# EAGLE design PoE_Mag-revc (EAGLE 8.5.0)
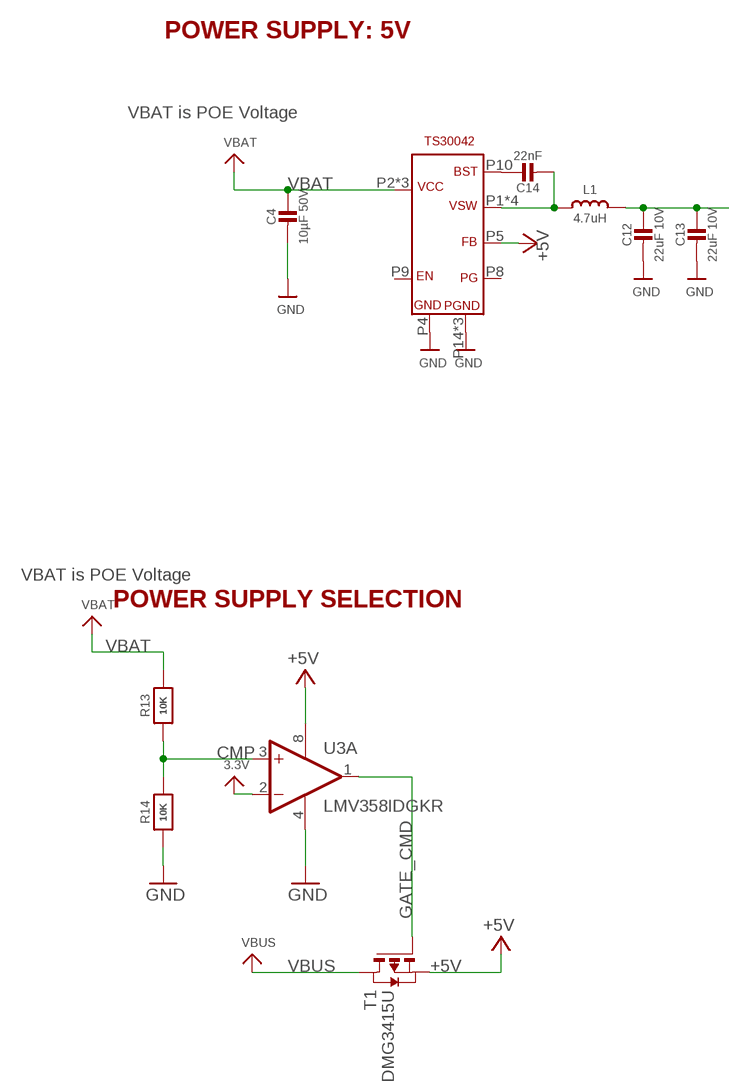
[diagram p0: schematic, sheet 1, part 1 of 2]
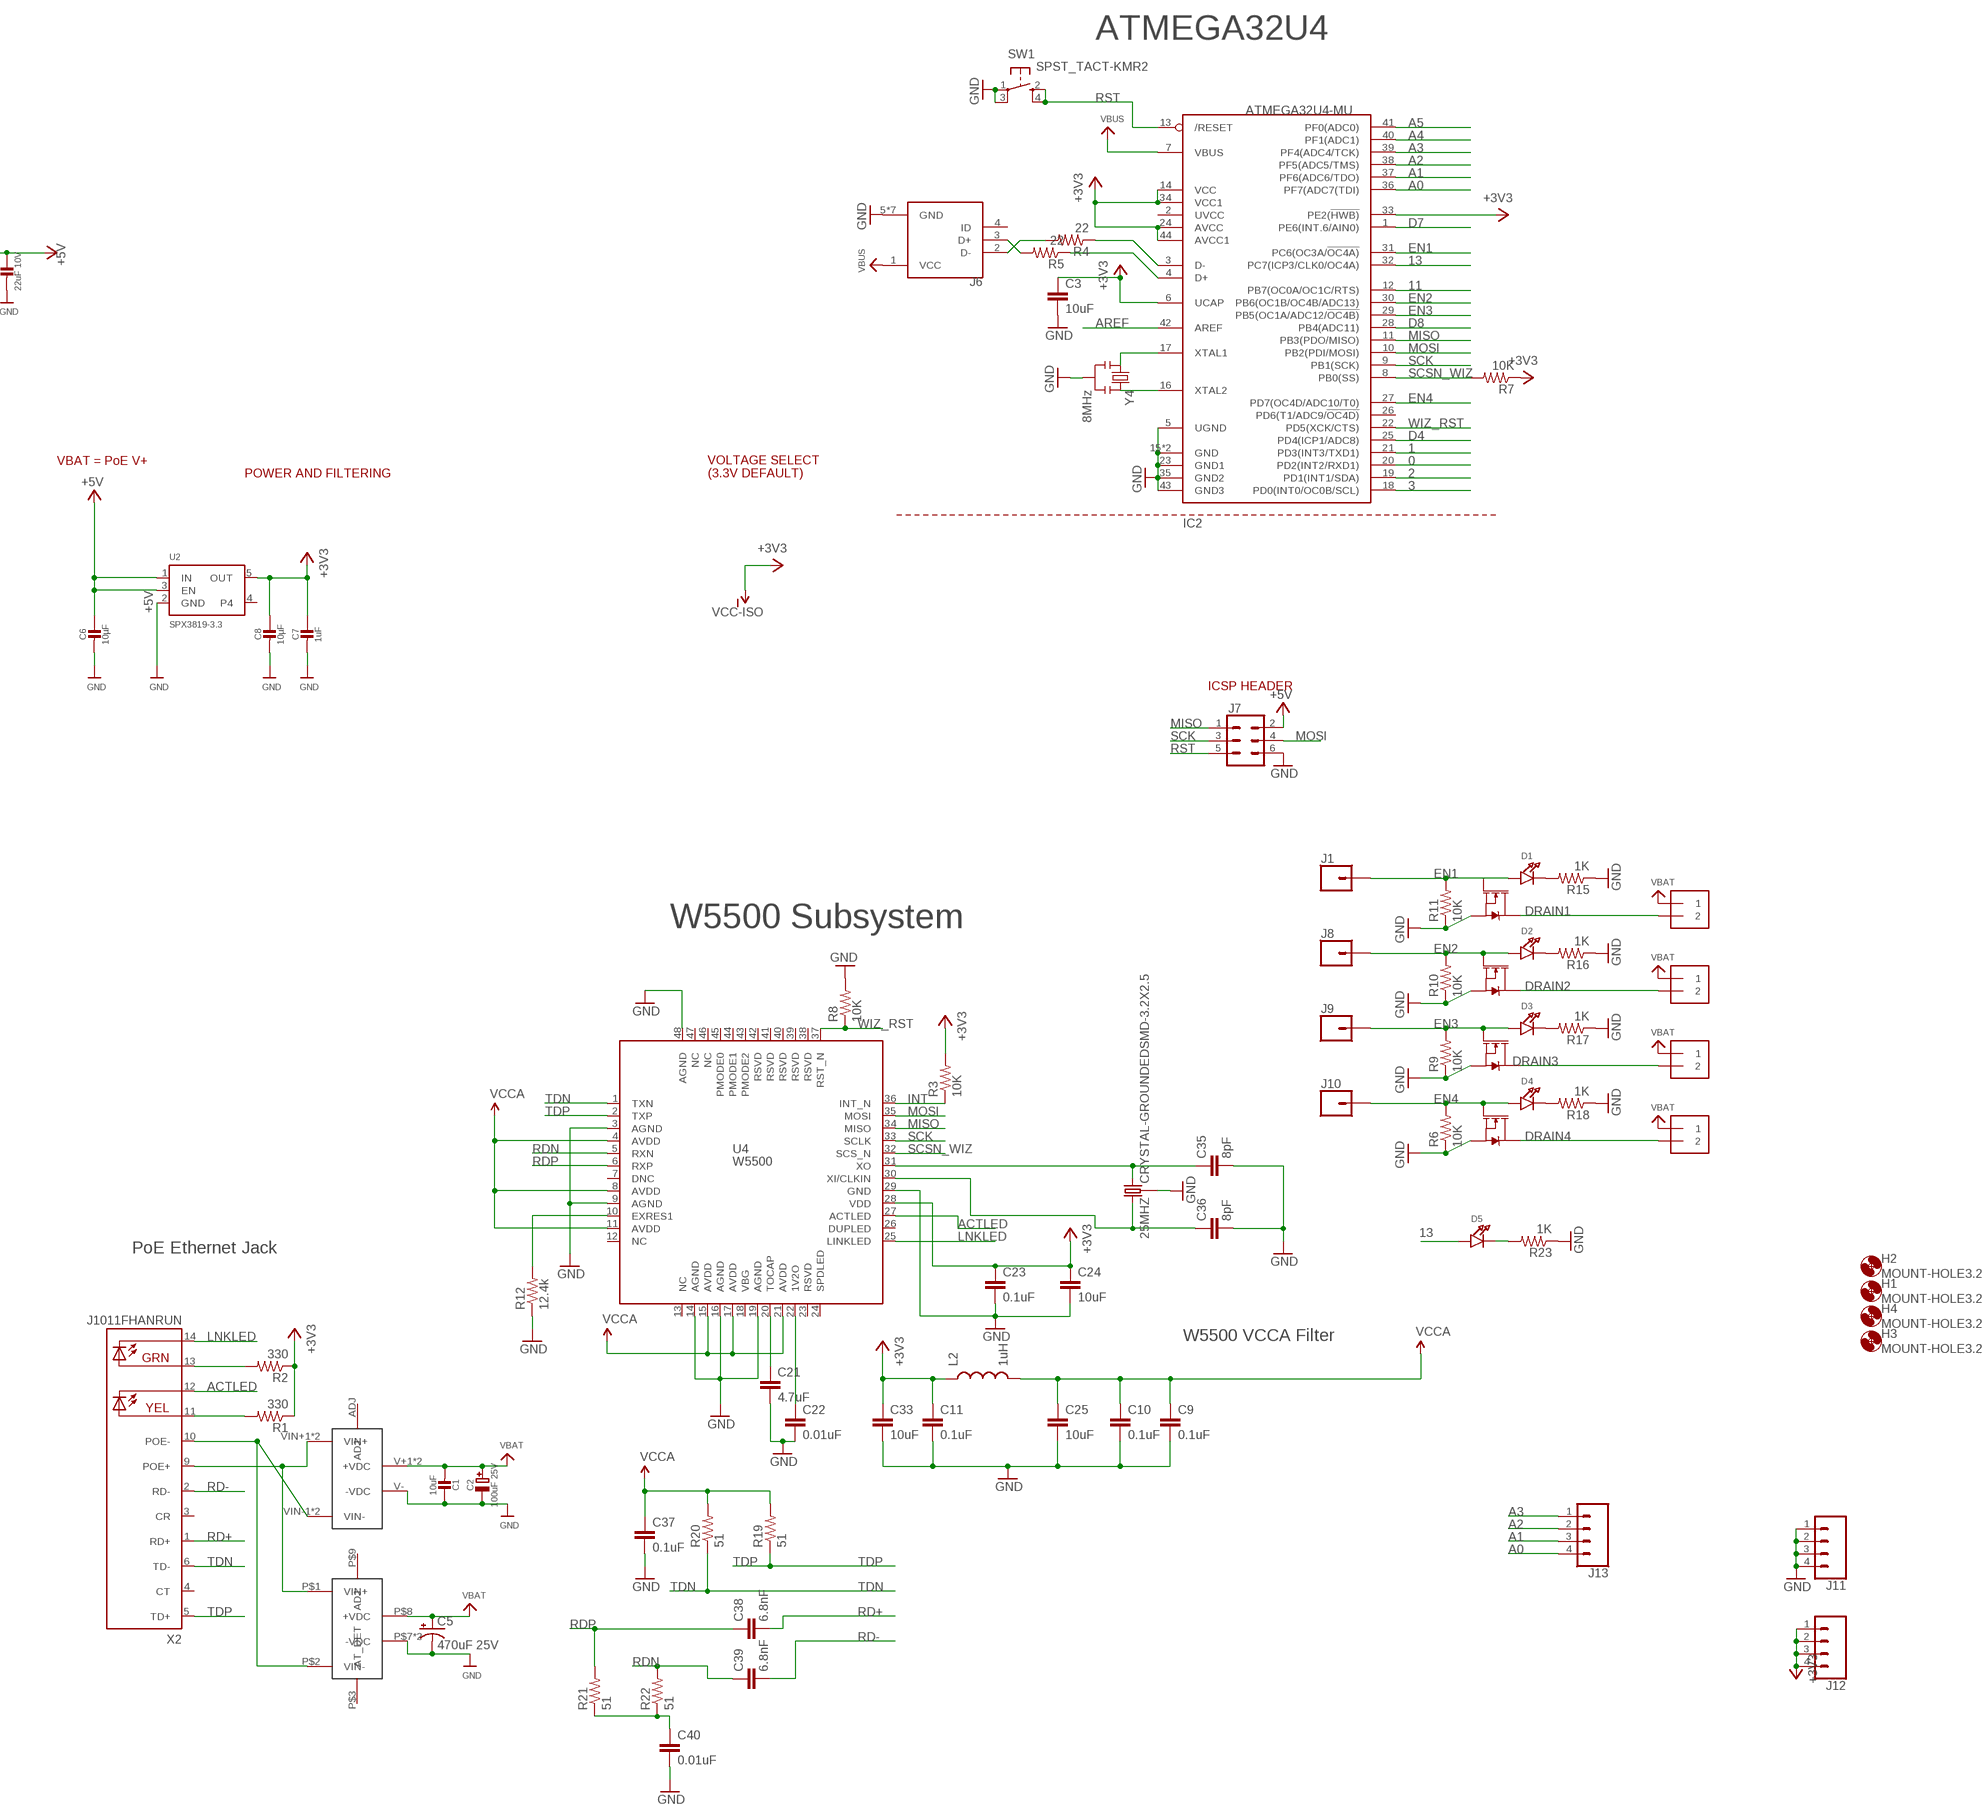
[diagram p1: schematic, sheet 1, part 2 of 2]

## Parts
25MHZ  CRYSTAL-GROUNDEDSMD-3.2X2.5  [CRYSTAL-SMD-3.2X2.5MM]
C1  10uF  CAP_CERAMIC_0805MP  [_0805MP]
C2  100uF 25V  CAP_ELECTROLYTICPANASONIC_D  [PANASONIC_D]
C3  10uF  CAP0603-CAP  [0603-CAP]
C4  10µF 50V  CAP_CERAMIC0603MINI  [0603-MINI]
C5  470uF 25V  CAP_POLG  [PANASONIC_G]
C6  10µF  CAP_CERAMIC0603MINI  [0603-MINI]
C7  1uF  CAP_CERAMIC0603MINI  [0603-MINI]
C8  10µF  CAP_CERAMIC0603MINI  [0603-MINI]
C9  0.1uF  CAP0603-CAP  [0603-CAP]
C10  0.1uF  CAP0603-CAP  [0603-CAP]
C11  0.1uF  CAP0603-CAP  [0603-CAP]
C12  22uF 10V  CAP_CERAMIC0603MINI  [0603-MINI]
C13  22uF 10V  CAP_CERAMIC0603MINI  [0603-MINI]
C14  22nF  CAP_CERAMIC0603MINI  [0603-MINI]
C21  4.7uF  CAP0603-CAP  [0603-CAP]
C22  0.01uF  CAP0603-CAP  [0603-CAP]
C23  0.1uF  CAP0603-CAP  [0603-CAP]
C24  10uF  CAP0603-CAP  [0603-CAP]
C25  10uF  CAP0603-CAP  [0603-CAP]
C33  10uF  CAP0603-CAP  [0603-CAP]
C35  8pF  CAP0603-CAP  [0603-CAP]
C36  8pF  CAP0603-CAP  [0603-CAP]
C37  0.1uF  CAP0603-CAP  [0603-CAP]
C38  6.8nF  CAP0603-CAP  [0603-CAP]
C39  6.8nF  CAP0603-CAP  [0603-CAP]
C40  0.01uF  CAP0603-CAP  [0603-CAP]
D1  LED0805_NOOUTLINE  [CHIPLED_0805_NOOUTLINE]
D2  LED0805_NOOUTLINE  [CHIPLED_0805_NOOUTLINE]
D3  LED0805_NOOUTLINE  [CHIPLED_0805_NOOUTLINE]
D4  LED0805_NOOUTLINE  [CHIPLED_0805_NOOUTLINE]
D5  LED0805_NOOUTLINE  [CHIPLED_0805_NOOUTLINE]
H1  MOUNT-HOLE3.2  [3,2]
H2  MOUNT-HOLE3.2  [3,2]
H3  MOUNT-HOLE3.2  [3,2]
H4  MOUNT-HOLE3.2  [3,2]
IC2  ATMEGA32U4-MU  [TQFN44_7MM]
J1  CONN_01  [1X01]
J2  1X2-3.5MM  [1X2-3.5MM]
J3  1X2-3.5MM  [1X2-3.5MM]
J4  1X2-3.5MM  [1X2-3.5MM]
J5  1X2-3.5MM  [1X2-3.5MM]
J6  10103594-0001LF  [FCI_10103594-0001LF]
J7  CONN_03X2NO_SILK  [2X3-NS]
J8  CONN_01  [1X01]
J9  CONN_01  [1X01]
J10  CONN_01  [1X01]
J11  CONN_04  [1X04]
J12  CONN_04  [1X04]
J13  CONN_041X04_NO_SILK  [1X04_NO_SILK]
L1  4.7uH  INDUCTORTDK_VLC5045  [INDUCTOR_5X5MM_TDK_VLC5045]
L2  1uH  INDUCTOR0603  [0603]
Q1  35A/25V/8.5mΩ  MOSFET-NCH-FDD8780  [DPAK]
Q3  35A/25V/8.5mΩ  MOSFET-NCH-FDD8780  [DPAK]
Q5  35A/25V/8.5mΩ  MOSFET-NCH-FDD8780  [DPAK]
Q6  35A/25V/8.5mΩ  MOSFET-NCH-FDD8780  [DPAK]
R1  330  RESISTOR0603-RES  [0603-RES]
R2  330  RESISTOR0603-RES  [0603-RES]
R3  10K  RESISTOR0603-RES  [0603-RES]
R4  22  RESISTOR0603-RES  [0603-RES]
R5  22  RESISTOR0603-RES  [0603-RES]
R6  10K  RESISTOR0603-RES  [0603-RES]
R7  10K  RESISTOR0603-RES  [0603-RES]
R8  10K  RESISTOR0603-RES  [0603-RES]
R9  10K  RESISTOR0603-RES  [0603-RES]
R10  10K  RESISTOR0603-RES  [0603-RES]
R11  10K  RESISTOR0603-RES  [0603-RES]
R12  12.4k  RESISTOR0603-RES  [0603-RES]
R13  10K  RESISTOR_0603_NOOUT  [0603-NO]
R14  10K  RESISTOR_0603_NOOUT  [0603-NO]
R15  1K  RESISTOR0603-RES  [0603-RES]
R16  1K  RESISTOR0603-RES  [0603-RES]
R17  1K  RESISTOR0603-RES  [0603-RES]
R18  1K  RESISTOR0603-RES  [0603-RES]
R19  51  RESISTOR0603-RES  [0603-RES]
R20  51  RESISTOR0603-RES  [0603-RES]
R21  51  RESISTOR0603-RES  [0603-RES]
R22  51  RESISTOR0603-RES  [0603-RES]
R23  1K  RESISTOR0603-RES  [0603-RES]
SW1  SPST_TACT-KMR2  [KMR2]
T1  DMG3415U  PMOSSOT23  [SOT-23]
U2  SPX3819-3.3  VREG_SOT23-5  [SOT23-5]
U3  LMV358IDGKR  LMV358MMX  [MSOP08]
U4  W5500  [W5500]
U$1  SILVERTEL_POEMICRO  [AG9900]
U$16  AG5200AG5300  [AG5300]
U$19  BUCK_CONVERTER  [QFN-16]
X2  J1011FHANRUN  [HANRUN_POE]
Y4  8MHz  RESONATORSMD  [RESONATOR-SMD]

## Nets
0: IC2.20(PD2(INT2/RXD1))
1: IC2.21(PD3(INT3/TXD1))
2: IC2.19(PD1(INT1/SDA))
3: IC2.18(PD0(INT0/OC0B/SCL))
11: IC2.12(PB7(OC0A/OC1C/RTS))
13: D5.A IC2.32(PC7(ICP3/CLK0/OC4A))
+3V3: C3.1 C7.1 C8.1 C11.1 C23.1 C24.1 C33.1 IC2.6(UCAP) IC2.14(VCC) IC2.24(AVCC) IC2.33(PE2(!HWB)) IC2.34(VCC1) IC2.44(AVCC1) J12.1 J12.2 J12.3 J12.4 L2.1 R1.1 R2.1 R3.2 R7.1 U2.5(OUT) U3.2(A:-IN) U4.28(VDD) ; supply symbol labelled VCC-ISO, 3.3V
+5V [usbvcc]: C6.1 C12.1 C13.1 J7.2 L1.P$2 T1.2(S) U2.1(IN) U2.3(EN) U3.8(P:V+) U$19.P5(FB)
A0: IC2.36(PF7(ADC7(TDI)) J13.4
A1: IC2.37(PF6(ADC6/TDO)) J13.3
A2: IC2.38(PF5(ADC5/TMS)) J13.2
A3: IC2.39(PF4(ADC4/TCK)) J13.1
A4: IC2.40(PF1(ADC1))
A5: IC2.41(PF0(ADC0))
ACTLED: U4.27(ACTLED) X2.12(YEL-C)
AREF: IC2.42(AREF)
CMP: R13.1 R14.2 U3.3(A:+IN)
D4: IC2.25(PD4(ICP1/ADC8))
D7: IC2.1(PE6(INT.6/AIN0))
D8: IC2.28(PB4(ADC11))
D+: IC2.4(D+) R5.1
D-: IC2.3(D-) R4.1
DRAIN1: J2.2 Q1.4(D)
DRAIN2: J3.2 Q3.4(D)
DRAIN3: J4.2 Q5.4(D)
DRAIN4: J5.2 Q6.4(D)
EN1: D1.A IC2.31(PC6(OC3A/!OC4A)) J1.1 Q1.1(G) R11.2
EN2: D2.A IC2.30(PB6(OC1B/OC4B/ADC13)) J8.1 Q3.1(G) R10.2
EN3: D3.A IC2.29(PB5(OC1A/ADC12/!OC4B)) J9.1 Q5.1(G) R9.2
EN4: D4.A IC2.27(PD7(OC4D/ADC10/T0)) J10.1 Q6.1(G) R6.2
GATE_CMD: T1.3(G) U3.1(A:OUT)
GND: 25MHZ.2 25MHZ.4 C1.1 C2.- C3.2 C4.2 C5.- C6.2 C7.2 C8.2 C9.2 C10.2 C11.2 C12.2 C13.2 C21.2 C22.2 C23.2 C24.2 C25.2 C33.2 C35.2 C36.2 C37.2 C40.2 IC2.5(UGND) IC2.15(GND) IC2.23(GND1) IC2.35(GND2) IC2.43(GND3) IC2.THERMAL(GND) J6.5(GND) J6.P1(GND) J6.P2(GND) J6.P3(GND) J6.P4(GND) J6.P5(GND) J6.P6(GND) J7.6 J11.1 J11.2 J11.3 J11.4 Q1.3(S) Q3.3(S) Q5.3(S) Q6.3(S) R6.1 R8.2 R9.1 R10.1 R11.1 R12.1 R14.1 R15.1 R16.1 R17.1 R18.1 R23.1 SW1.1(P) SW1.3(P1) U2.2(GND) U3.4(P:V-) U4.3(AGND) U4.9(AGND) U4.14(AGND) U4.16(AGND) U4.19(AGND) U4.29(GND) U4.48(AGND) U$1.V-(-VDC) U$16.P$7(-VDC) U$16.P$10(-VDC) U$19.P4(GND) U$19.P14(PGND) U$19.P15(PGND) U$19.PAD(PGND) Y4.2
INT: R3.1 U4.36(INT_N)
LNKLED: U4.25(LINKLED) X2.14(GRN-C)
MISO: IC2.11(PB3(PDO/MISO)) J7.1 U4.34(MISO)
MOSI: IC2.10(PB2(PDI/MOSI)) J7.4 U4.35(MOSI)
N$1: U$1.VIN-1(VIN-) U$1.VIN-2(VIN-) U$16.P$2(VIN-) X2.10(POE-)
N$2: U$1.VIN+1(VIN+) U$1.VIN+2(VIN+) U$16.P$1(VIN+) X2.9(POE+)
N$3: R2.2 X2.13(GRN-A)
N$4: R1.2 X2.11(YEL-A)
N$5: D1.C R15.2
N$6: J6.3(D+) R5.2
N$7: D2.C R16.2
N$8: D3.C R17.2
N$9: D4.C R18.2
N$10: D5.C R23.2
N$11: IC2.16(XTAL2) Y4.3
N$12: IC2.17(XTAL1) Y4.1
N$13: J6.2(D-) R4.2
N$14: C14.1 U$19.P10(BST)
N$15: C14.2 L1.P$1 U$19.P1(VSW) U$19.P12(VSW) U$19.P13(VSW) U$19.P16(VSW)
N$18: C21.1 U4.20(TOCAP)
N$19: C22.1 U4.22(1V2O)
N$20: R12.2 U4.10(EXRES1)
N$23: C40.1 R21.1 R22.1
N$25: 25MHZ.3 C35.1 U4.31(XO)
N$26: 25MHZ.1 C36.1 U4.30(XI/CLKIN)
RD+: C38.2 X2.1(RD+)
RD-: C39.2 X2.2(RD-)
RDN: C39.1 R22.2 U4.5(RXN)
RDP: C38.1 R21.2 U4.6(RXP)
RST: IC2.13(/RESET) J7.5 SW1.2(S) SW1.4(S1)
SCK: IC2.9(PB1(SCK)) J7.3 U4.33(SCLK)
SCSN_WIZ: IC2.8(PB0(SS)) R7.2 U4.32(SCS_N)
TDN: R20.1 U4.1(TXN) X2.6(TD-)
TDP: R19.1 U4.2(TXP) X2.5(TD+)
VBAT: C1.2 C2.+ C4.1 C5.+ J2.1 J3.1 J4.1 J5.1 R13.2 U$1.V+1(+VDC) U$1.V+2(+VDC) U$16.P$8(+VDC) U$19.P2(VCC) U$19.P3(VCC) U$19.P11(VCC)
VBUS: IC2.7(VBUS) J6.1(VCC) T1.1(D)
VCCA: C9.1 C10.1 C25.1 C37.1 L2.2 R19.2 R20.2 U4.4(AVDD) U4.8(AVDD) U4.11(AVDD) U4.15(AVDD) U4.17(AVDD) U4.21(AVDD)
WIZ_RST: IC2.22(PD5(XCK/CTS)) R8.1 U4.37(RST_N)
Unconnected: IC2.2(UVCC) IC2.26(PD6(T1/ADC9/!OC4D)) J6.4(ID) U2.4 U3.5(B:+IN) U3.6(B:-IN) U3.7(B:OUT) U4.7(DNC) U4.12(NC) U4.13(NC) U4.18(VBG) U4.23(RSVD) U4.24(SPDLED) U4.26(DUPLED) U4.38(RSVD) U4.39(RSVD) U4.40(RSVD) U4.41(RSVD) U4.42(RSVD) U4.43(PMODE2) U4.44(PMODE1) U4.45(PMODE0) U4.46(NC) U4.47(NC) U$1.ADJ U$16.P$3(AT_DET) U$16.P$9(ADJ) U$19.P8(PG) U$19.P9(EN) X2.3(CR) X2.4(CT)

## Notes on the sheet
- ATMEGA32U4
- POWER SUPPLY: 5V
- VBAT is POE Voltage
- VBAT = PoE V+
- POWER AND FILTERING
- VOLTAGE SELECT
  (3.3V DEFAULT)
- VBAT is POE Voltage
- POWER SUPPLY SELECTION
- ICSP HEADER
- W5500 Subsystem
- PoE Ethernet Jack
- W5500 VCCA Filter

## Library data of the parts
25MHZ = SparkFun-Clocks:CRYSTAL-GROUNDED: Crystals w/ Ground Pin (Generic) These are passive quartz crystals, which can be used as a clock source for a microcontroller. Crystal's are usually two-terminal devices. A third terminal may be optionally connected to ground, as recommended by the manufaturer.
C1 C4 C6-C8 C12-C14 = microbuilder:CAP_CERAMIC: Ceramic Capacitors For new designs, use the packages preceded by an '_' character since they are more reliable: The following footprints should be used on most boards: _0402 - Standard footprint for regular board layouts _0603 - Standard footprint for regular board layouts _0805 - Standard footprint for regular board layouts _1206 - Standard footprint for regular board layouts For extremely tight-pitch boards where space is at a premium, the following 'micro-pitch' footprints can be used (smaller pads, no silkscreen outline, etc.): _0402MP - Micro-pitch footprint for very dense/compact boards _0603MP - Micro-pitch footprint for very dense/compact boards _0805MP - Micro-pitch footprint for very dense/compact boards _1206MP - Micro-pitch footprint for very dense/compact boards
C2 = microbuilder:CAP_ELECTROLYTIC: Electrolytic Capacitors SMT PANASONIC_C - Size C Panasonic Electrolytic Aluminum Capacitor 47µF 16V 20% Electrolytic Capacitor [Digikey: PCE3890TR-ND] PANASONIC_D - Size D Panasonic Electrolytic Aluminum Capacitor 100µF 25V 20% Electrolytic Capacitor [Digikey: PCE3898TR-ND] PTH 3.5 mm grid, 8 mm diameter ... 3.5 mm grid, 10 mm diameter ...
C3 C9-C11 C21-C25 C33 C35-C40 = SparkFun-Passives:CAP: Capacitor Standard 0603 ceramic capacitor, and 0.1" leaded capacitor.
C5 = SparkFun-Passives:CAP_POL: Capacitor Polarized These are standard SMD and PTH capacitors. Normally 10uF, 47uF, and 100uF in electrolytic and tantalum varieties. Always verify the external diameter of the through hole cap, it varies with capacity, voltage, and manufacturer. The EIA devices should be standard.
D1-D5 = microbuilder:LED: LED 0603 - 0603 Surface Mount Package 2mA: Green LED - Low Power (3.9mcd, 2ma, 1.7Vf) - Digikey: 475-2709-2-ND Orange LED - Low Power (9.8mcd, 2ma, 1.8Vf) - Digikey: 475-1194-2-ND Red LED - Low Power (5mcd, 2ma, 1.8Vf) - Digikey: 475-1195-2-ND Yellow LED - Low Power (7mcd, 2ma, 1.8Vf) - Digikey: 475-1196-2-ND 5mA: Blue LED - Low Power (17mcd, 5ma, 2.9Vf) - Digikey: LNJ937W8CRACT-ND 0805 - 0805 Surface Mount Package 2mA: Red LED (8.8mcd, 2mA, 1.8Vf, Clear) - Low Power [Digikey: 475-2510-1-ND] Green LED (5mcd, 2mA, 1.8Vf, Clear) - Low Power [Digikey: 475-2730-1-ND] Yellow LED (11.3mcd, 2mA, 1.8Vf, Clear) - Low Power [Digikey: 475-2555-1-ND] 20mA: Red LED (104mcd, 20mA, Diffused) - LS R976 [Digikey: 475-1278-6-ND] Red LED (12mcd, 20mA, 2.0Vf, Clear) - APT2012EC [Digikey: 754-1128-1-ND] Green LED (15mcd, 20mA, 2.2Vf, Clear) - APT2012GC [Digikey: 754-1131-1-ND] Orange LED (160mcd, 20mA, 2.1Vf, Clear) - APT2012SECK [Digikey: 754-1130-1-ND] 1206 - 1206 Surface Mount Package Green LED (26mcd, 20mA, Diffused) - LG N971 [Digikey: 475-1407-6-ND] Red LED (15mcd, 20mA, Diffused) - LH N974 [Digikey: 475-1416-6-ND] Cree - Cree High-Power Surface Mount LEDs XPEBWT-L1-0000-00D50 - White 111lm 350mA 2.9Vf 6200K 110° XTEAWT-00-0000-00000LEE3 - White 114lm 350mA 2.85Vf 5000K 115° Everlight - Everlight 45-21 Series Surface Mount LEDs 45-21/QK2C-B2832AC2CB2/2T - Warm White 2000mcd 20mA 3.25Vf 3050K 120° 45-21/LK2C-B38452C4CB2/2T - Nuetral White 2000mcd 20mA 3.25Vf 4150K 120° 45-21/LK2C-B50634C6CB2/2T - Cold White 2200mcd 20mA 3.25Vf 5650K 120° PLCC2 Reverse Mount LS T77K-J1L2-1-0-2-R18-Z - Red 11.25mcd 2mA 1.8Vf 630nm 120° LO T77K-L1M2-24-Z - Orange 19.6mcd 2mA 1.8Vf 606nm 120° LY T77K-K2M1-26-Z - Yellow 15.7mcd 2mA 1.8Vf 587nm 120°
H1-H4 = holes:MOUNT-HOLE: MOUNTING HOLE with drill center marker
IC2 = microbuilder:ATMEGA32U4: http://www.ladyada.net/library/eagle
J1 J8-J10 = SparkFun-Connectors:CONN_01: Single connection point. Often used as Generic Header-pin footprint for 0.1 inch spaced/style header connections On any of the 0.1 inch spaced packages, you can populate with these: Break Away Headers - Straight <https://www.sparkfun.com/products/116> (PRT-00116) Break Away Male Headers - Right Angle <https://www.sparkfun.com/products/553> (PRT-00553) Female Headers <https://www.sparkfun.com/products/115> (PRT-00115) Break Away Headers - Machine Pin <https://www.sparkfun.com/products/117> (PRT-00117) Break Away Female Headers - Swiss Machine Pin <https://www.sparkfun.com/products/743> (PRT-00743) This device is also useful as a general connection point to wire up your design to another part of your project. Our various solder wires solder well into these plated through hole pads. Hook-Up Wire - Assortment (Stranded, 22 AWG) <https://www.sparkfun.com/products/11375> (PRT-11375) Hook-Up Wire - Assortment (Solid Core, 22 AWG) <https://www.sparkfun.com/products/11367> (PRT-11367) View the entire wire category on our website here <https://www.sparkfun.com/categories/141> Special notes: SMTSO-256-ET is a "flush mount" nut for a 4-40 screw. We mostly use this on specialty testbeds; it is a nice way to connect hardware to your PCB at an adjustable hieght. Also note, the SNAP packages are for using a snappable style connector. We sell a baggie of snaps and they are also used on two LilyPad designs: Snap Assortment - 30 pack (male and female) <https://www.sparkfun.com/products/11347> (DEV-11347) LilyPad Arduino SimpleSnap <https://www.sparkfun.com/products/10941> (DEV-10941) LilyPad SimpleSnap Protoboard <https://www.sparkfun.com/products/10940> (DEV-10940)
J2-J5 = adafruit:1X2: 3.5mm Terminal block http://www.ladyada.net/library/pcb/eaglelibrary.html
J6 = 10103594-0001LF:10103594-0001LF: Conn Micro USB Type B RCP 5 POS 0.65mm Solder RA SMD 5 Terminal 1 Port T/R; AVAILABILITY: Good; DESCRIPTION: Conn Micro USB Type B RCP 5 POS 0.65mm Solder RA SMD 5 Terminal 1 Port T/R; MF: FCI; MP: 10103594-0001LF; PACKAGE: None; PRICE: 0.40 USD
J7 = SparkFun-Connectors:CONN_03X2: Multi connection point. Often used as Generic Header-pin footprint for 0.1 inch spaced/style header connections You can populate with any combo of single row headers, but if you'd like an exact match, check these: Header - 2x3 (Male, 0.1") <https://www.sparkfun.com/products/12807> (PRT-12807) Header - 2x3 (Female, 0.1") <https://www.sparkfun.com/products/13010> (PRT-13010) 2x3 Pin Shrouded Header <https://www.sparkfun.com/products/10877> (PRT-10877) On any of the 0.1 inch spaced packages, you can populate with these: Break Away Headers - Straight <https://www.sparkfun.com/products/116> (PRT-00116) Break Away Male Headers - Right Angle <https://www.sparkfun.com/products/553> (PRT-00553) Female Headers <https://www.sparkfun.com/products/115> (PRT-00115) Break Away Headers - Machine Pin <https://www.sparkfun.com/products/117> (PRT-00117) Break Away Female Headers - Swiss Machine Pin <https://www.sparkfun.com/products/743> (PRT-00743) Special note: the shrouded connector mates well with our 3x2 ribbon cables: Ribbon Crimp Connector - 6-pin (2x3, Female) <https://www.sparkfun.com/products/10651> (PRT-10651) Ribbon Cable - 6 wire (15ft) <https://www.sparkfun.com/products/10646> (PRT-10646)
J11-J13 = SparkFun-Connectors:CONN_04: Multi connection point. Often used as Generic Header-pin footprint for 0.1 inch spaced/style header connections On any of the 0.1 inch spaced packages, you can populate with these: Break Away Headers - Straight <https://www.sparkfun.com/products/116> (PRT-00116) Break Away Male Headers - Right Angle <https://www.sparkfun.com/products/553> (PRT-00553) Female Headers <https://www.sparkfun.com/products/115> (PRT-00115) Break Away Headers - Machine Pin <https://www.sparkfun.com/products/117> (PRT-00117) Break Away Female Headers - Swiss Machine Pin <https://www.sparkfun.com/products/743> (PRT-00743) For SCREWTERMINALS and SPRING TERMINALS visit here: Screw Terimnals on SparkFun.com <https://www.sparkfun.com/search/results?term=Screw+Terminals> (5mm/3.5mm/2.54mm spacing) This device is also useful as a general connection point to wire up your design to another part of your project. Our various solder wires solder well into these plated through hole pads. Hook-Up Wire - Assortment (Stranded, 22 AWG) <https://www.sparkfun.com/products/11375> (PRT-11375) Hook-Up Wire - Assortment (Solid Core, 22 AWG) <https://www.sparkfun.com/products/11367> (PRT-11367) View the entire wire category on our website here <https://www.sparkfun.com/categories/141> Special notes: Molex polarized connector foot print use with SKU : PRT-08231 with associated crimp pins and housings. 1MM SMD Version SKU: PRT-10208; PROD_ID: CONN-09696
L1 = microbuilder:INDUCTOR: Inductors
L2 = SparkFun-Passives:INDUCTOR: Inductors
Q1 Q3 Q5 Q6 = SparkFun-DiscreteSemi:MOSFET-NCH: N-channel MOSFETs Voltage controlled devices that allow control of high current outputs. SparkFun Products: SparkFun OpenScale <https://www.sparkfun.com/products/13261> SparkFun Digital Sandbox <https://www.sparkfun.com/products/12651> SparkFun Monster Moto Shield <https://www.sparkfun.com/products/10182> SparkFun MOSFET Power Controller <https://www.sparkfun.com/products/11214>; PROD_ID: TRANS-09984
R1-R12 R15-R23 = SparkFun-Passives:RESISTOR: Resistor Basic schematic elements and footprints for 0603, 1206, and PTH resistors.
R13 R14 = microbuilder:RESISTOR: Resistors For new designs, use the packages preceded by an '_' character since they are more reliable: The following footprints should be used on most boards: _0402 - Standard footprint for regular board layouts _0603 - Standard footprint for regular board layouts _0805 - Standard footprint for regular board layouts _1206 - Standard footprint for regular board layouts For extremely tight-pitch boards where space is at a premium, the following 'micro-pitch' footprints can be used (smaller pads, no silkscreen outline, etc.): _0402MP - Micro-pitch footprint for very dense/compact boards _0603MP - Micro-pitch footprint for very dense/compact boards _0805MP - Micro-pitch footprint for very dense/compact boards _1206MP - Micro-pitch footprint for very dense/compact boards
SW1 = adafruit:SPST_TACT: SMT 6mm switch, EVQQ2 series http://www.ladyada.net/library/eagle
T1 = zetex:PMOSSOT23: MOS FET; OC_FARNELL: unknown; OC_NEWARK: unknown
U2 = microbuilder:VREG_SOT23-5: SOT23-5 Fixed Voltage Regulators Part Current Out V Out V In V Dropout θJA (°C/W) TJ (°C) Digikey Part No. ADP121 150mA 3.3V 3.4-5.5V 0.09V @ 150mA -- -- ADP121-AUJZ33R7CT-ND ADP121 150mA 3.0V 3.1-5.5V 0.09V @ 150mA -- -- ADP121-AUJZ30R7CT-ND ADP122 300mA 3.3V 3.4-5.5V 0.085V @ 300mA -- -- ADP122AUJZ-3.3-R7CT-ND ADP1712 300mA 3.3V 3.5-5.5V 0.17V @ 300mA -- -- ADP1712AUJZ-3.3-R7TR-ND AP7311 (Low Cost) 150mA 3.3V 3.5-6V 0.15V @ 150mA -- -- AP7311-33WG-7DICT-ND LD39015M18R 150mA 1.8V 1.9V-5.5V 0.08V @ 100mA -- -- 497-6977-1-ND LP2985A-33DBVR 150mA 3.3V 3.3-16V 0.28V @ 150mA 206 150 296-18479-1-ND MCP1824T-3302E/OT 300mA 3.3V 3.5V-6V 0.2V @ 300mA -- -- MCP1824T-3302E/OTCT-ND MIC5205-2.5YM5 TR 150mA 2.5V 2.7-16V 0.165V @ 150mA -- -- 576-1257-2-ND MIC5205-3.0YM5 TR 150mA 3.0V 3.2V-16V 0.165V @ 150mA -- -- 576-1258-2-ND MIC5205-3.3YM5 TR 150mA 3.3V 3.5V-16V 0.165V @ 150mA -- -- 576-1259-2-ND TPS780330220 150mA 3.3V+2.2V 3.6-5.5V 250mV Max -- -- 296-23332-1-ND TDA3663/N1,135 100mA 3.3V 3.5-45V 0.18V @ 50mA -- -- 568-5343-1-ND Max operating temp can be calculated using θJA, TJ (max junction temperature), and power in watts. Set the "Maximum Ambient Temperature" until it reaches TJ ("Max Junction Temperature"), which is the absolute limit for safe use of the regulator: Heat Sink Temperature Calculator <http://www.daycounter.com/Calculators/Heat-Sink-Temperature-Calculator.phtml> For example, With 12V source into a 3.3V LP2985 and a 30mA load, we are dissipating (12V-3.3V) * 0.03A = 0.261W. With a θJA of 206 °C/W, a TJ of 150°C, and 261mW we can safely use the chip without a heat sink up to 75°C (=147.1°C Junction Temperature).
U3 = linear:LMV358?*: Dual General Purpose, Low Voltage, Rail-to-Rail Output Operational Amplifiers Source: http://www.national.com/mpf/LM/LMV321.html http://www.national.com/dt/lmv_qual.pdf
U4 = W5500:W5500
U$1 = Heep:SILVERTEL_POE
U$16 = Heep:AG5200
U$19 = Heep:BUCK_CONVERTER
X2 = Heep:J1011F: PULSEJACK (TM) 1x1 Tab-UP RJ45 10/100 Base-TX RJ45 1x1 Tab-UP with LEDs 8-pin (J1 series) and 6-pin (JP series) integrated magnetics connector, designed to support applications, such as ADSL modems, LAN-on-Motherboard, and Hub and Switches. Source: www.pulseeng.com .. PulseJack-J402.pdf
Y4 = SparkFun:RESONATOR: Resonator Small SMD resonator. This is the itty bitty 10/20MHz resonators with built in caps. CSTCE10M0G55 and CSTCE20M0V53. Footprint has been reviewed closely but hasn't been tested yet.

## Net classes
3 usbvcc: width 0.305 mm, drill 0.483 mm, clearance 0.203 mm

## Board
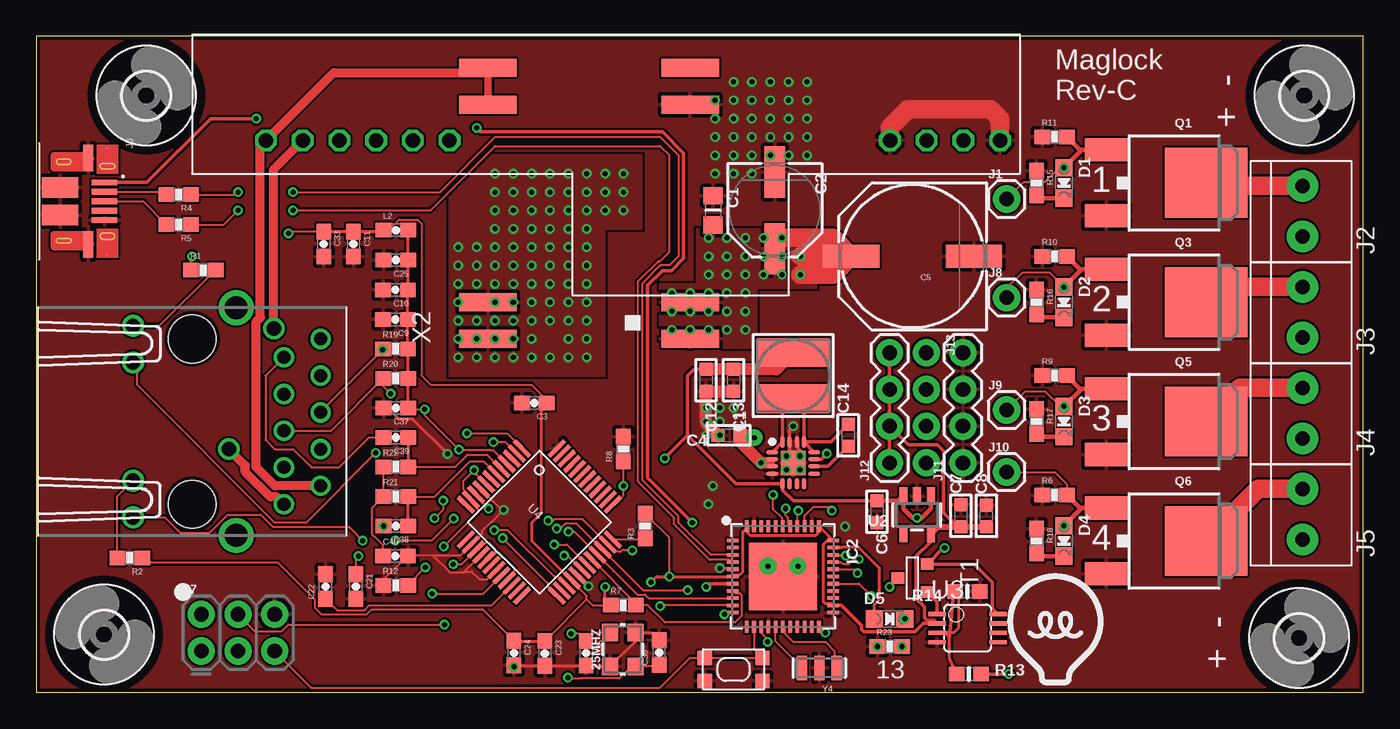
[diagram p2: board, top side]
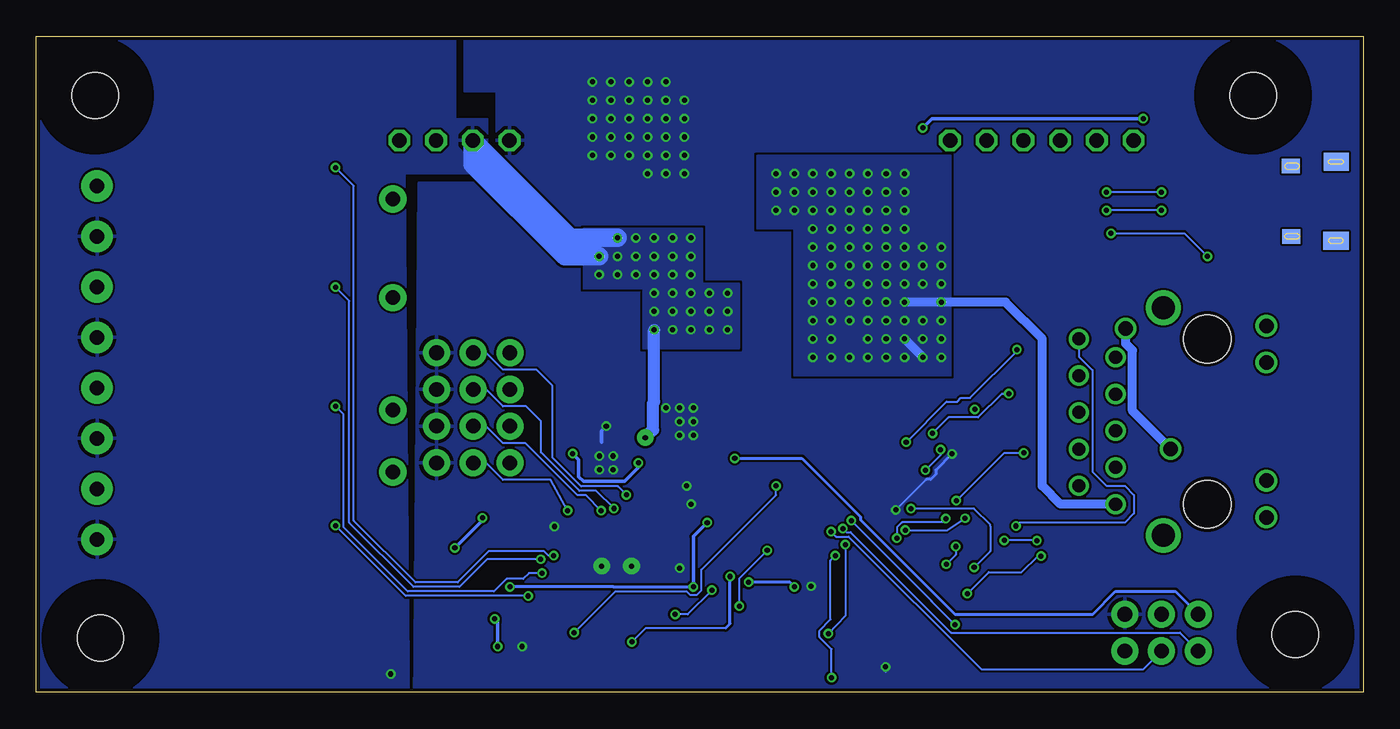
[diagram p3: board, bottom side, seen from below]

Size 91.84 x 45.39 mm. Coordinates in mm from the lower left corner, seen from the top.
Outline: 0,0 91.84,0 91.84,45.39 0,45.39 0,0
Copper layers (1*16): Top 0.035mm / dielectric 1.5mm / Bottom 0.035mm
Design rules "SeeedStudio_2layer_DRU_no_angle_20140221": minimum track width 6mil, minimum drill 12mil, track to track 6mil, track to pad 6mil, pad to pad 6mil, via to via 6mil, smd to smd 0mil, copper to edge 10mil, drill to drill 10mil, minimum pad ring 10mil, minimum via ring 6mil, stop-mask expansion 2mil, vias tented up to drill 100mil, thermal gap 10mil

### Footprints (pad centres in the part's own frame; a part is rotated, then mirrored left to right if it is on the bottom)
CRYSTAL-SMD-3.2X2.5MM = smd 1.2 x 1.1: 1 -1.175,-0.875; 2 1.175,-0.875; 3 1.175,0.875; 4 -1.175,0.875
_0805MP = smd 1.2 x 1.3: 1 -1.016,0; 2 1.016,0
PANASONIC_D = smd 3.556 x 1.4: + 2.654,0; - -2.654,0
0603-CAP = smd 1.1 x 1: 1 -0.85,0; 2 0.85,0
0603-MINI = smd 0.9 x 0.9: 1 -0.75,0; 2 0.75,0
PANASONIC_G = smd 3.9 x 1.6: + 4.25,0; - -4.25,0
CHIPLED_0805_NOOUTLINE = smd 1.2 x 1.2: A 0,-1.05; C 0,1.05
3,2 = hole 3.2: 0,0
TQFN44_7MM = smd 0.25 x 0.8: 1 -2.5,-3.475; 2 -2,-3.475; 3 -1.5,-3.475; 4 -1,-3.475; 5 -0.5,-3.475; 6 0,-3.475; 7 0.5,-3.475; 8 1,-3.475; 9 1.5,-3.475; 10 2,-3.475; 11 2.5,-3.475; 23 2.5,3.475; 24 2,3.475; 25 1.5,3.475; 26 1,3.475; 27 0.5,3.475; 28 0,3.475; 29 -0.5,3.475; 30 -1,3.475; 31 -1.5,3.475; 32 -2,3.475; 33 -2.5,3.475 | smd 0.8 x 0.25: 12 3.475,-2.5; 13 3.475,-2; 14 3.475,-1.5; 15 3.475,-1; 16 3.475,-0.5; 17 3.475,0; 18 3.475,0.5; 19 3.475,1; 20 3.475,1.5; 21 3.475,2; 22 3.475,2.5; 34 -3.475,2.5; 35 -3.475,2; 36 -3.475,1.5; 37 -3.475,1; 38 -3.475,0.5; 39 -3.475,0; 40 -3.475,-0.5; 41 -3.475,-1; 42 -3.475,-1.5; 43 -3.475,-2; 44 -3.475,-2.5 | smd 4.7 x 4.7: THERMAL 0,0
1X01 = drill 1.016 pad 1.88: 1 0,0
1X2-3.5MM = drill 1 pad 2.184: 1 1.8,0; 2 -1.7,0
FCI_10103594-0001LF = smd 0.4 x 1.75: 1 -1.3,2.825; 2 -0.65,2.825; 3 0,2.825; 4 0.65,2.825; 5 1.3,2.825 | smd 0.1 x 0.1: P1 -3.7,3; P2 3.7,3 | smd 1.825 x 0.7: P3 -2.987,1.7; P4 2.987,1.7 | smd 1.425 x 2.5: P5 -0.963,-0.25; P6 0.963,-0.25 | smd 1.25 x 1.75 bottom: P$1 -2.731,-0.026; P$2 2.726,-0.018 | smd 1 x 1.25 bottom: P$3 -2.422,3.111; P$4 2.427,3.078
2X3-NS = drill 1.016 pad 1.88: 1 -2.54,-1.27; 2 -2.54,1.27; 3 0,-1.27; 4 0,1.27; 5 2.54,-1.27; 6 2.54,1.27
1X04 = drill 1.016 pad 1.88: 1 0,0; 2 2.54,0; 3 5.08,0; 4 7.62,0
1X04_NO_SILK = drill 1.016 pad 1.88: 1 0,0; 2 2.54,0; 3 5.08,0; 4 7.62,0
INDUCTOR_5X5MM_TDK_VLC5045 = smd 2 x 5: P$1 -1.6,0; P$2 1.6,0
0603 = smd 1.1 x 1: 1 -0.85,0; 2 0.85,0
DPAK = smd 1.6 x 3: 1 -2.28,-5.31; 3 2.28,-5.31 | smd 4.826 x 5.715: 4 0,1.588
0603-RES = smd 1.1 x 1: 1 -0.85,0; 2 0.85,0
0603-NO = smd 1.075 x 1: 1 -0.85,0; 2 0.85,0
KMR2 = smd 1 x 1: 1 2,0.8; 2 2,-0.8; 3 -2,0.8; 4 -2,-0.8
SOT-23 = smd 0.787 x 0.889: 1 0.025,-1.016; 2 -0.94,1.016; 3 0.991,1.016
SOT23-5 = smd 0.55 x 1.2: 1 -0.95,-1.3; 2 0,-1.3; 3 0.95,-1.3; 4 0.95,1.3; 5 -0.95,1.3
MSOP08 = smd 0.3 x 1.2: 1 -0.976,-2.113; 2 -0.326,-2.113; 3 0.324,-2.113; 4 0.974,-2.113; 5 0.974,2.112; 6 0.324,2.112; 7 -0.326,2.112; 8 -0.976,2.112
W5500 = smd 1.5 x 0.3: 1 -4.45,2.75; 2 -4.45,2.25; 3 -4.45,1.75; 4 -4.45,1.25; 5 -4.45,0.75; 6 -4.45,0.25; 7 -4.45,-0.25; 8 -4.45,-0.75; 9 -4.45,-1.25; 10 -4.45,-1.75; 11 -4.45,-2.25; 12 -4.45,-2.75; 25 4.45,-2.75; 26 4.45,-2.25; 27 4.45,-1.75; 28 4.45,-1.25; 29 4.45,-0.75; 30 4.45,-0.25; 31 4.45,0.25; 32 4.45,0.75; 33 4.45,1.25; 34 4.45,1.75; 35 4.45,2.25; 36 4.45,2.75 | smd 0.3 x 1.5: 13 -2.75,-4.45; 14 -2.25,-4.45; 15 -1.75,-4.45; 16 -1.25,-4.45; 17 -0.75,-4.45; 18 -0.25,-4.45; 19 0.25,-4.45; 20 0.75,-4.45; 21 1.25,-4.45; 22 1.75,-4.45; 23 2.25,-4.45; 24 2.75,-4.45; 37 2.75,4.45; 38 2.25,4.45; 39 1.75,4.45; 40 1.25,4.45; 41 0.75,4.45; 42 0.25,4.45; 43 -0.25,4.45; 44 -0.75,4.45; 45 -1.25,4.45; 46 -1.75,4.45; 47 -2.25,4.45; 48 -2.75,4.45
AG9900 = smd 1.25 x 4: ADJ 18.75,0; V+1 0,0; V+2 2.54,0; V- 16.21,0; VIN+1 18.75,14; VIN+2 16.21,14; VIN-1 2.54,14; VIN-2 0,14
AG5300 = drill 1 octagon: P$1 5.11,2.3; P$2 7.65,2.3; P$3 10.19,2.3; P$4 12.73,2.3; P$5 15.27,2.3; P$6 17.81,2.3; P$7 48.29,2.3; P$8 50.83,2.3; P$9 53.37,2.3; P$10 55.91,2.3
QFN-16 = smd 0.8 x 0.3: P1 -1.45,0.75; P2 -1.45,0.25; P3 -1.45,-0.25; P4 -1.45,-0.75; P9 1.45,-0.75; P10 1.45,-0.25; P11 1.45,0.25; P12 1.45,0.75 | smd 0.3 x 0.8: P5 -0.75,-1.45; P6 -0.25,-1.45; P7 0.25,-1.45; P8 0.75,-1.45; P13 0.75,1.45; P14 0.25,1.45; P15 -0.25,1.45; P16 -0.75,1.45 | smd 1.7 x 1.7: PAD 0,0
HANRUN_POE = drill 0.9 pad 1.3: 1 5.715,-8.89; 2 4.445,-6.35; 3 3.175,-8.89; 4 1.905,-6.35; 5 0.635,-8.89; 6 -0.635,-6.35; 7 -1.905,-8.89; 8 -3.175,-6.35; 9 -4.445,-8.89; 10 -5.715,-6.35 | drill 1 pad 1.422: 11 6.625,4.08; 12 4.085,4.08; 13 -4.085,4.08; 14 -6.625,4.08 | drill 1.6 pad 2.184: M1 7.875,-3.05; M2 -7.875,-3.05 | hole 3.3: -5.715,0; 5.715,0
RESONATOR-SMD = smd 0.7 x 1.7: 1 -1.2,0; 2 0,0; 3 1.2,0

### Placement (x,y rotation side)
25MHZ  40.59,2.97 90 top
C1  46.84,33.34 270 top
C2  51.11,33.34 270 top
C3  34.47,20.03 180 top
C4  47.94,17.78 180 top
C5  60.64,30.16 180 top
C6  58.18,12.49 270 top
C7  63.99,12.22 90 top
C8  65.75,12.2 90 top
C9  24.87,25.8 180 top
C10  24.87,27.85 180 top
C11  21.96,31 270 top
C12  46.36,21.59 270 top
C13  48.26,21.59 270 top
C14  56.2,17.78 90 top
C21  22.13,7.31 270 top
C22  20.03,7.32 90 top
C23  35.21,2.7 270 top
C24  33.07,2.72 270 top
C25  24.88,29.9 180 top
C33  19.9,31 270 top
C35  38.05,2.71 270 top
C36  43.11,2.76 90 top
C37  24.88,19.68 180 top
C38  24.88,11.51 180 top
C39  24.9,17.64 180 top
C40  24.87,9.44 0 top
D1  71.12,35.24 180 top
D2  71.12,26.99 180 top
D3  71.12,18.73 180 top
D4  71.12,10.48 180 top
D5  59.05,5.08 270 top
H1  87.75,41.28 0 top
H2  4.71,4 270 top
H3  7.62,41.28 0 top
H4  87.39,3.75 0 top
IC2  51.67,8.01 270 top
J1  67.15,34.13 0 top
J2  87.63,33.34 270 top
J3  87.63,26.35 270 top
J4  87.63,19.37 270 top
J5  87.63,12.38 270 top
J6  1.91,33.97 270 top
J7  13.97,4.13 0 top
J8  67.15,27.3 0 top
J9  67.15,19.53 0 top
J10  67.15,15.24 0 top
J11  64.13,15.87 90 top
J12  59.05,15.87 90 top
J13  61.59,23.5 270 top
L1  52.39,21.91 90 top
L2  24.9,31.97 0 top
Q1  79.38,35.24 270 top
Q3  79.38,26.99 270 top
Q5  79.38,18.73 270 top
Q6  79.38,10.48 270 top
R1  11.56,29.2 0 top
R2  6.48,9.3 180 top
R3  42.14,11.51 90 top
R4  9.87,34.43 180 top
R5  9.87,32.35 180 top
R6  70.48,13.65 0 top
R7  40.64,6.03 0 top
R8  40.64,16.83 90 top
R9  70.48,21.91 0 top
R10  70.48,30.16 0 top
R11  70.48,38.42 0 top
R12  24.88,7.41 0 top
R13  64.55,1.27 0 top
R14  64.45,6.99 180 top
R15  69.21,35.24 270 top
R16  69.21,26.99 270 top
R17  69.21,18.73 270 top
R18  69.21,10.48 270 top
R19  24.87,23.76 0 top
R20  24.88,21.73 0 top
R21  24.89,13.55 0 top
R22  24.89,15.59 0 top
R23  59.05,3.18 0 top
SW1  48.26,1.59 180 top
T1  60.64,7.94 270 top
U2  60.95,12.28 180 top
U3  64.45,4.45 270 top
U4  34.82,11.78 315 top
U$1  45.26,24.45 90 top
U$15  [HEEPLOGOSMALL]  66.04,-0.32 0 top
U$16  10.79,35.88 0 top
U$19  52.39,15.87 0 top
X2  10.79,18.73 90 top
Y4  54.2,1.7 180 top

### Tracks (layer width: path | path; a pad name or v marks a point on that pad's centre or on a via)
13
  Top 0.2: D5.A 58.01,6.07 58.37,6.43 58.37,8.59 56.91,10.04 55.79,10.04 55.76,10.01 IC2.32
+3V3  (via drill 0.35)
  Top 0.152: L2.1 24.37,31.97 25.1,32.7 26.39,32.7 26.67,32.42 26.67,21.91 27.3,21.27 34.29,21.27 35.32,20.25 C3.1 | C23.1 38.1,6.44 | 38.1,6.44 38.1,6.67 37.08,7.69 U4.28 | 38.1,6.44 38.51,6.03 R7.1 | v50.62,3.49 50.62,3.68 50.16,4.13 IC2.14 | v43.82,8.01 43.82,10.68 R3.2 | C33.1 17.56,31.85 v17.46,31.75 | v10.79,30.16 10.71,30.08 R1.1 | R2.1 7.64,8.98 16.74,8.98 19.3,6.42 19.3,5.82 19.74,5.38 22.85,5.38 23.18,5.71 30.92,5.71 C24.1
  Top 0.2: 65.74,11.47 C8.1 | C24.1 33.08,3.55 C23.1 | L2.1 23.92,31.85 C11.1 | C11.1 | C11.1 C33.1 | IC2.34 54.05,11.37 54.05,10.99 53.9,10.84 49.44,10.84 49.29,10.99 49.29,11.37 IC2.44
  Top 0.203: C8.1 65.92,11.29 | 54.89,10.77 IC2.33 | 54.89,10.77 IC2.34 | IC2.44 49.17,11.39 48.9,11.11 48.9,8.33 48.7,8.14 48.32,8.14 IC2.6 v43.82,8.01 42.93,8.01 v42.55,7.63 | R7.1 39.37,6.45 v39.37,7.3 | C3.1 34.93,19.64 34.93,12.38 34.29,11.75 34.29,10.48 37.02,7.75 U4.28 | IC2.24 55.03,6.14 54.64,6.14 54.49,6.28 54.49,10.25 54.89,10.65 54.89,10.77
  Top 0.254: IC2.24 55.16,6.03 55.72,6.03 57.13,4.63 57.13,4.36 57.29,4.2 60.82,4.2 61.39,4.77 U3.2 62.12,4.99 61.62,4.99 61.46,5.16 61.46,5.91 60.88,6.49 60.88,9.41 61.9,10.43 U2.5 | J12.1 J12.2 | J12.2 J12.3 J12.4 | 64.01,11.45 63.77,11.45 62.79,12.44 62.79,15.34 62.81,15.37 62.81,16.68 62.37,17.13 60.34,17.13 J12.2
  Top 0.406: U2.5 62.4,11.47 C7.1 64.01,11.45 C8.1
  Bottom 0.152: 44.13,4.45 49.66,4.45 v50.62,3.49 | v17.46,31.75 12.38,31.75 v10.79,30.16
  Bottom 0.203: v39.37,7.3 39.7,7.63 v42.55,7.63 | 44.13,4.45 43.82,4.76 v43.82,8.01
+5V  (via drill 0.35)
  Top 0.254: v43.5,16.19 45.09,17.78 | 45.09,17.78 45.09,21.91 45.52,22.34 C12.1 | C6.1 52.39,13.24 51.66,13.98 51.66,14.41 U$19.P5 48.44,14.42 45.09,17.78 | U3.8 66.17,5.82 66.17,7.62 64.91,8.88 T1.2 62.78,10 v62.87,10
  Top 0.305: C6.1 59.67,13.24 U2.3 60,12.7 60.64,12.07 v60.96,12.07 61.28,12.07 61.91,12.7 U2.1
  Top 0.813: 51.86,22.98 L1.P$2 51.22,22.34 C13.1 C12.1
  Bottom 0.203: v43.5,16.19 38.85,16.19 34.8,12.14 34.8,11.94 28.26,5.4 18.73,5.4 17.14,6.99 13.02,6.99 J7.2
  Bottom 0.254: v62.87,10 60.96,11.91 v60.96,12.07
A0  (via drill 0.35)
  Top 0.152: IC2.36 53.17,12.21 53.77,12.8 54.82,12.8 v55.06,12.56
  Bottom 0.152: J13.4 60.71,15.87 59.54,14.71 56.23,14.71 v55.06,12.56
A1  (via drill 0.35)
  Top 0.152: IC2.37 52.67,12.52 v52.74,12.58
  Bottom 0.152: J13.3 60.71,18.42 59.54,17.25 57.98,17.25 54.38,13.64 53.79,13.64 v52.74,12.58
A2  (via drill 0.35)
  Top 0.152: IC2.38 52.02,11.64 52.02,12.08 51.86,12.25 v51.86,12.72
  Bottom 0.152: J13.2 60.71,20.96 59.54,19.79 57.93,19.79 56.91,18.76 56.91,16.6 54.25,13.94 53.09,13.94 v51.86,12.72
A3  (via drill 0.35)
  Top 0.152: IC2.39 51.63,11.53 51.63,12.04 51,12.68 v51,13.67
  Bottom 0.152: v51,13.67 51.58,14.25 54.12,14.25 56.11,16.24 56.11,21.21 57.22,22.33 59.54,22.33 60.71,23.49 J13.1
ACTLED  (via drill 0.35)
  Top 0.152: v28.17,13.26 28.17,12.64 v27.57,12.04 | U4.27 36.09,8.02 35.84,8.02 32.64,11.22 v31.7,11.22 | v23.49,16.57 18.67,11.75 16.51,11.75 6.99,21.27 6.99,22.55 X2.12
  Bottom 0.152: v31.7,11.22 28.8,11.2 v27.57,12.04 | v28.17,13.26 28.15,13.25 24.83,16.57 v23.49,16.57
CMP
  Top 0.203: R13.1 63.19,2.35 63.19,3.73 63.5,7.23 63.18,3.81 62.87,4.12 | 62.87,4.12 U3.3 | R14.2 63.82,6.77 63.82,4.45 63.49,4.12 62.87,4.12
D+  (via drill 0.35)
  Top 0.152: v17.78,33.34 27.3,33.34 31.75,37.78 43.18,37.78 43.82,37.15 43.82,30.47 43.18,29.83 43.05,29.83 41.66,28.44 41.66,14.56 44.15,12.07 44.15,11.62 46.61,9.16 48.05,9.16 IC2.4 | R5.1 12.98,32.35 v13.97,33.34
  Bottom 0.152: v13.97,33.34 v17.78,33.34
D-  (via drill 0.35)
  Top 0.152: IC2.3 46.68,9.51 44.45,11.75 44.45,12.2 41.97,14.68 41.97,28.31 43.18,29.53 43.82,29.53 44.45,30.16 44.45,37.15 43.18,38.42 31.75,38.42 27.94,34.61 v17.78,34.61 | R4.1 13.79,34.43 v13.97,34.61
  Bottom 0.152: v13.97,34.61 v17.78,34.61
DRAIN1
  Top 1.27: J2.2 81.17,35.04 Q1.4
DRAIN2
  Top 1.27: J3.2 82.03,28.05 Q3.4
DRAIN3
  Top 1.27: J4.2 83.3,21.07 Q5.4
DRAIN4
  Top 1.27: J5.2 84.57,14.08 Q6.4
EN1  (via drill 0.35)
  Top 0.152: 55.94,9.46 v56.03,9.46 55.2,9.46 IC2.31 | J1.1 68.33,35.31 69.81,35.31 70.79,36.29 D1.A
  Top 0.305: R11.2 72.23,37.52 72.35,37.52 | D1.A 72.35,37.52 | 72.35,37.52 Q1.1
  Bottom 0.152: v56.03,9.46 56.39,9.46 56.7,9.76 60.52,9.76 62.67,7.61 65.6,7.61 69.86,11.87 69.86,35.04 D1.A
  other vias: 71.12,36.29
EN2  (via drill 0.35)
  Top 0.152: v56.93,9.21 56.56,9.21 56.26,8.9 55.8,8.9 55.68,9.01 IC2.30 | D2.A 70.11,29.05 68.26,29.05 67.15,27.94 J8.1
  Top 0.305: R10.2 72.23,29.27 72.35,29.27 | D2.A 72.35,29.27 | 72.35,29.27 Q3.1
  Bottom 0.152: v56.93,9.21 60.64,9.21 62.55,7.3 65.72,7.3 70.17,11.75 70.17,27.08 D2.A
  other vias: 71.12,28.04
EN3  (via drill 0.35)
  Top 0.152: IC2.29 56.57,8.51 v56.83,8.25 | D3.A 70.86,19.78 69.85,20.8 68.42,20.8 J9.1
  Top 0.305: R9.2 72.23,21.01 Q5.1 72.35,21.01 D3.A
  Bottom 0.152: D3.A 70.56,19.23 70.56,11.43 66.12,6.99 60.16,6.99 59.29,7.86 58.13,7.86 57.74,8.25 v56.83,8.25
  other vias: 71.12,19.78
EN4  (via drill 0.35)
  Top 0.152: IC2.27 56.94,7.51 v57.79,6.67 | J10.1 70.48,15.24 71.33,14.39 R6.2
  Top 0.305: R6.2 72.23,12.76 72.35,12.76 | D4.A 72.35,12.76 | 72.35,12.76 Q6.1
  Bottom 0.152: v57.79,6.67 66.26,6.67 D4.A
  other vias: 71.12,11.53
GATE_CMD
  Top 0.254: T1.3 62.34,6.27 U3.1
GND  (via drill 0.35, 0.35 pad 1.15)
  Top 0.152: 24.02,7.8 C40.2 27.44,9.5 | 32.21,12.62 U4.9 | 27.44,9.5 28.64,8.31 29.58,8.31 29.63,8.36 | 27.44,9.5 29.36,9.5 U4.14 30.12,10.22 30.85,10.95 30.85,11.17 31.47,11.78 31.51,11.78 v32.35,12.62 | 37.51,8.1 U4.29 | U4.29 37.44,8.13 | 29.63,8.36 U4.16 | 29.63,8.36 30.14,8.36 30.68,7.81 31.2,7.81 U4.19 | U4.29 37.45,8.1 v38.21,7.34 | IC2.5 48.12,8.6 v47.31,8.6
  Top 0.2: 23.64,7.1 R12.1 24.02,7.8 | v28.46,16.5 26.03,18.93 25.08,18.93 24.33,19.68 C37.2 | 32.21,12.62 v32.35,12.62 | 33.07,1.42 v33.07,1.76 C24.2 33.08,1.85 C23.2 C35.2 38.11,1.8 25MHZ.4 41.46,3.55 41.46,4.1 | 41.46,4.1 25MHZ.2 | C36.2 42.62,4.1 41.46,4.1
  Top 0.254: v52.39,18.42 52.14,18.17 U$19.P15 52.14,16.58 v51.91,16.35 | U$19.P14 52.71,17.25 52.71,16.9 52.86,16.74 v52.86,16.35
  Top 0.813: C4.2 46.36,18.62 v46.36,18.73 v46.36,19.69 C12.2 C13.2
  Top 1.27: U$16.P$10 66.67,38.21 66.67,39.69 66.04,40.32 60.33,40.32 59.09,39.08 U$16.P$7
  Bottom 0.152: 30.24,14.73 v32.35,12.62 | 33.07,1.42 v33.07,1.76
  Bottom 0.2: 30.24,14.73 29.93,14.73 29.59,15.07 29.59,15.37 v28.46,16.5
  Bottom 0.254: v52.39,18.42 52.71,18.1 52.71,17.3
  other vias: 48.26,42.23 49.53,42.23 50.8,42.23 52.07,42.23 53.34,42.23 53.34,40.96 52.07,40.96 50.8,40.96 49.53,40.96 48.26,40.96 46.99,40.96 46.99,39.69 48.26,39.69 49.53,39.69 49.53,38.42 50.8,39.69 52.07,39.69 53.34,39.69 53.34,37.15 53.34,38.42 52.07,38.42 52.07,37.15 50.8,38.42 50.8,37.15 49.53,37.15 49.53,35.88 48.26,35.88 48.26,37.15 48.26,38.42 46.99,38.42 46.99,37.15 46.99,35.88 58.21,3.18 46.36,17.78 47.31,19.69 47.31,18.73 47.31,17.78 48.26,19.69 51.91,15.4 52.86,15.4 50.64,8.73 52.71,8.73 46.51,13.02 46.83,14.29 55.97,11.47
  pour Top (rank 2): -6.98,47.94 95.88,47.94 95.88,-0.95 -6.98,-0.95
  pour Bottom: 39.37,43.5 53.98,43.5 53.98,34.61 45.72,34.61 45.72,39.69 39.37,39.69
  pour Bottom (rank 2): 65.72,-0.95 -1.91,-0.95 -1.91,51.75 62.23,51.75 62.23,41.59 60.01,41.59 60.01,35.24 65.41,35.24
INT
  Top 0.152: U4.36 42.06,10.58 R3.1
LNKLED  (via drill 0.35)
  Top 0.152: 21.75,11.34 v22.59,10.5 21.65,11.44 16.38,11.44 15.54,12.29 13.25,12.29 12,11.04 9.97,11.04 8.9,12.11 X2.14 | v28.89,12.01 27.39,10.52 v24.85,10.52 | 36.02,6.78 U4.25 35.4,7.31 35.4,7.55 v32.29,10.67
  Bottom 0.152: v28.89,12.01 29.11,11.79 31.9,11.79 31.91,11.78 31.93,11.78 32.26,11.46 32.26,10.99 32.24,10.98 32.24,10.96 32.29,10.92 v32.29,10.67 | v22.59,10.5 22.61,10.52 v24.85,10.52
MISO  (via drill 0.35)
  Top 0.152: v45.09,7.07 42,7.07 U4.34 37.41,11.67 36.6,11.67 36.26,11.33 v36.02,11.33 | v47.62,5.4 47.74,5.51 IC2.11
  Bottom 0.152: v45.09,7.07 46.76,5.4 v47.62,5.4 | v36.02,11.33 35.77,11.08 35.49,11.08 28.54,4.13 12.7,4.13 J7.1
MOSI  (via drill 0.35)
  Top 0.152: IC2.10 43.24,6.01 v43.18,5.96 | v41.25,9.82 40.53,9.82 40.43,9.71 40.07,9.71 U4.35 37.81,11.97 35.88,11.97 35.79,11.88 v35.43,11.88 | v28.26,4.68 17.45,4.68 16.99,4.23 15.14,4.23 J7.4
  Bottom 0.152: v43.18,5.96 43.18,7.89 v41.25,9.82 | v35.43,11.88 29.87,6.32 | 29.87,6.32 29.82,6.27 | v28.26,4.68 29.87,6.3 29.87,6.32
N$1  (via drill 0.35, 1)
  Top 0.61: X2.10 16.64,13.53 16.19,13.53 14.48,15.24 14.48,15.68 v13.34,16.83 | v16.45,25.16 16.45,36.18 U$16.P$2
  Bottom 0.61: X2.10 20.95,13.02 22.22,14.29 22.22,24.45 24.76,26.99 v31.75,26.99 | 30.65,23.34 v31.75,24.45 | v16.45,25.16 16.45,24.12 15.98,23.66 15.98,19.48 v13.34,16.83
  other vias: 40.64,35.88 40.64,34.61 40.64,33.34 39.37,35.88 39.37,34.61 39.37,33.34 38.1,33.34 38.1,34.61 38.1,35.88 38.1,32.07 38.1,30.8 38.1,29.53 36.83,32.07 36.83,30.8 36.83,29.53 35.56,29.53 35.56,30.8 35.56,32.07 36.83,35.88 36.83,34.61 36.83,33.34 35.56,34.61 35.56,33.34 34.29,33.34 34.29,34.61 33.02,35.88 33.02,34.61 33.02,33.34 30.48,30.8 30.48,29.53 29.21,30.8 29.21,29.53 34.29,32.07 34.29,30.8 34.29,29.53 33.02,32.07 33.02,30.8 33.02,29.53 31.75,29.53 31.75,30.8 31.75,32.07 34.29,28.26 34.29,26.99 34.29,25.72 33.02,28.26 33.02,26.99 33.02,25.72 31.75,25.72 31.75,28.26 38.1,28.26 38.1,26.99 38.1,25.72 36.83,28.26 36.83,26.99 36.83,25.72 35.56,25.72 35.56,26.99 35.56,28.26 38.1,24.45 38.1,23.18 36.83,24.45 36.83,23.18 35.56,23.18 30.48,28.26 30.48,25.72 29.21,28.26 29.21,26.99 29.21,25.72 30.48,24.45 30.48,23.18 29.21,24.45 29.21,23.18 34.29,24.45 34.29,23.18 33.02,24.45 33.02,23.18 31.75,23.18 35.56,35.88 34.29,35.88 31.75,35.88 31.75,34.61 31.75,33.34
  pour Top: 41.91,37.15 28.57,37.15 28.57,21.91 39.37,21.91 39.37,32.07 41.91,32.07
  pour Bottom: 41.91,37.15 28.57,37.15 28.57,21.91 39.37,21.91 39.37,32.07 41.91,32.07
N$2
  Top 0.508: U$1.VIN+1 U$1.VIN+2
  Top 0.61: U$1.VIN+1 30.92,42.86 20.59,42.86 U$16.P$1 15.5,37.77 15.5,25.92 15.24,25.66 15.24,15.56 16.51,14.29 X2.9
N$3
  Top 0.152: R2.2 5.63,13.56 X2.13
N$4
  Top 0.152: X2.11 8.53,25.36 12.38,29.2 R1.2
N$5
  Top 0.305: R15.2 69.41,34.19 D1.C
N$6
  Top 0.152: R5.2 7.39,33.97 J6.3
N$7
  Top 0.305: R16.2 69.41,25.94 D2.C
N$8
  Top 0.305: R17.2 69.41,17.68 D3.C
N$9
  Top 0.305: R18.2 69.41,9.43 D4.C
N$10  (via drill 0.35)
  Bottom 0.254: R23.2 59.91,4.88 D5.C
  other vias: 59.91,3.18 60.11,5.08
N$11
  Top 0.152: Y4.3 51.17,3.52 IC2.16
N$12
  Top 0.152: IC2.17 51.82,4.39 51.82,4.05 52.37,3.49 54.61,3.49 55.25,2.86 55.25,1.85 Y4.1
N$13
  Top 0.152: J6.2 8.83,34.62 R4.2
N$14
  Top 0.254: U$19.P10 54.79,15.63 C14.1
N$15
  Top 0.254: U$19.P13 53.14,19.56 L1.P$1 51.64,19.56 U$19.P16 U$19.P1 | U$19.P13 54.99,17.32 C14.2 | U$19.P12 U$19.P13
N$18  (via drill 0.35)
  Top 0.152: C21.1 22.13,9.25 v22.3,9.42 | v27.4,6.83 30.92,6.83 U4.20
  Bottom 0.152: v27.4,6.83 25.92,8.31 23.65,8.31 22.54,9.42 v22.3,9.42
N$19
  Top 0.152: U4.22 31.53,6.02 23.05,6.02 22.72,5.69 20.81,5.69 C22.1
N$20  (via drill 0.35)
  Top 0.152: R12.2 25.77,7.48 v26.93,8.64 | U4.10 30.43,13.58 v31.31,12.7
  Bottom 0.152: v31.31,12.7 26.93,12.7 25.81,11.58 25.81,11.5 25.81,9.76 v26.93,8.64
N$23
  Top 0.152: C40.1 24.02,10.18 23.42,10.78 23.39,10.78 23.25,10.91 23.25,12.76 R21.1 R22.1
N$25  (via drill 0.35)
  Top 0.152: 25MHZ.3 38.65,4.15 C35.1 37.55,4.05 v37.02,4.06 | v35.85,10.22 36.73,10.22 U4.31
  Bottom 0.152: v37.02,4.06 35.85,5.29 v35.85,10.22
N$26  (via drill 0.35)
  Top 0.152: C36.1 43.01,1.8 25MHZ.1 41.19,1.8 40.36,0.97 37.72,0.97 37.7,0.95 36.87,0.95 v36.79,1.02 | v36.53,9.46 36.79,9.46 U4.30
  Bottom 0.152: v36.79,1.02 36.79,3 37.63,3.83 37.63,4.28 36.87,5.04 36.87,9.12 v36.53,9.46
RD+  (via drill 0.35)
  Bottom 0.152: X2.1 19.68,23.23 18.75,22.29 18.75,15.26 17.78,14.29 16.51,14.29 15.88,13.65 15.88,12.38 16.51,11.75 23.79,11.75 C38.2
  other vias: 24.03,11.51
RD-
  Top 0.152: X2.2 15.88,21.91 15.88,17.46 16.51,16.83 17.78,16.83 19.05,15.56 | C39.2 23.04,17.64 20.95,15.56 19.05,15.56 | 19.05,15.56
RDN
  Top 0.152: R22.2 28.99,15.59 29.84,16.45 31.21,16.45 U4.5
  Top 0.2: R22.2 C39.1
RDP
  Top 0.152: R21.2 27.58,13.55 30.02,15.99 30.97,15.99 U4.6
  Top 0.2: R21.2 25.74,11.54 C38.1
RST
  Top 0.152: IC2.13 49.67,2.98 SW1.4 SW1.2 45.24,2.39 43.18,0.33 19.04,0.33 J7.5
SCK  (via drill 0.35)
  Top 0.152: IC2.9 42.38,6.51 42.14,6.76 41.61,6.76 U4.33 37.25,11.11 v36.83,11.11
  Bottom 0.152: v36.83,11.11 36.49,10.77 35.62,10.77 26.43,1.59 15.24,1.59 J7.3
SCSN_WIZ
  Top 0.152: U4.32 41.49,6.17 R7.2 42.32,6.03 43.51,4.84 48.37,4.84 48.83,5.3 48.83,6.73 48.69,6.87 48.34,6.87 IC2.8
TDN  (via drill 0.35)
  Top 0.152: 33.16,17.33 U4.1 32.57,17.92 v29.81,17.92 | v24.53,20.67 24.03,21.18 R20.1 20.4,18.1 X2.6
  Bottom 0.152: v24.53,20.67 25.01,20.67 26.66,19.02 28.7,19.02 v29.81,17.92
TDP  (via drill 0.35)
  Top 0.152: X2.5 19.68,19.42 v23.98,23.71 R19.1 | U4.2 32.48,17.31 v31.64,17.31
  Bottom 0.152: v31.64,17.31 28.84,20.1 28.09,20.1 27.83,20.36 27.21,20.36 23.98,23.6 v23.98,23.71
VBAT  (via drill 0.35, 0.35 pad 1.15)
  Top 0.254: U$19.P11 54.33,16.12 v54.72,16.51 | R13.2 v67.31,1.27
  Top 0.305: 50.94,15.87 U$19.P2 50.41,16.12 v50.16,15.87 | 50.94,15.87 U$19.P3 50.41,15.63 v50.16,15.87 | 50.94,15.87 v50.16,15.87
  Top 0.813: v50.16,15.87 48.69,17.35 C4.1 49.53,17.78 v49.69,17.62
  Top 1.27: C5.+ 55.12,28.89 v52.88,28.89 | C5.+ 55.12,31.43 v51.61,31.43 | v52.88,30.16 C5.+
  Bottom 0.254: v54.72,16.51 54.29,16.09 54.29,14.92 53.98,14.6 51.12,14.6 50.16,15.56 v50.16,15.87
  Bottom 0.813: v49.07,25.08 49.07,20.13 49.15,20.05 49.15,18.16 v49.69,17.62
  Bottom 1.27: v51.61,31.43 54.88,31.43 U$16.P$8 61.62,36.54 55.25,30.16 v52.88,30.16
  other vias: 46.53,31.43 47.8,31.43 49.07,31.43 50.34,31.43 51.61,30.16 50.34,30.16 49.07,30.16 47.8,30.16 46.53,30.16 46.53,28.89 47.8,28.89 49.07,28.89 50.34,28.89 51.61,28.89 46.53,27.62 45.26,27.62 43.99,27.62 43.99,26.35 43.99,25.08 45.26,25.08 45.26,26.35 46.53,26.35 46.53,25.08 47.8,25.08 49.07,26.35 47.8,26.35 47.8,27.62 49.07,27.62
  pour Bottom: 45.72,32.07 53.98,32.07 53.98,27.94 49.85,27.94 49.85,23.81 43.18,23.81 43.18,28.26 45.72,28.26
  pour Top: 45.72,32.07 53.98,32.07 53.98,27.94 52.07,27.94 49.85,27.94 49.85,24.13 49.53,23.81 43.18,23.81 43.18,28.26 45.72,28.26
  pour Bottom (rank 2): 62.87,50.48 62.87,39.69 60.64,39.69 60.64,35.88 66.36,35.88 66.04,-2.86 100.96,-3.49 100.96,50.48
VBUS  (via drill 0.35)
  Top 0.203: v59.05,7.3 59.63,7.87 T1.1
  Top 0.254: IC2.7 46.57,7.51 v46.36,7.3 | J6.1 7.65,35.27 12.06,39.69 v15.24,39.69 | v30.48,39.05 30.76,38.77 43.33,38.77 44.81,37.29 44.81,30.02 43.96,29.17 43.33,29.17 42.32,28.16 42.32,14.83 v45.4,11.75
  Bottom 0.203: v46.36,7.3 46.67,7.3 46.69,7.32 51.89,7.32 51.9,7.3 v59.05,7.3
  Bottom 0.254: v15.24,39.69 29.84,39.69 v30.48,39.05 | v45.4,11.75 46.36,10.8 v46.36,7.3
VCCA  (via drill 0.35)
  Top 0.152: v28.2,10.09 30.23,12.12 30.25,12.12 30.59,12.46 30.59,12.65 30.08,13.16 U4.11 30.08,13.51 29.57,14.02 29.57,14.63 v30.3,15.37 30.3,15.23 U4.8 | v28.87,8.86 29.43,8.86 U4.15 30.61,9.87 31.12,10.38 31.31,10.38 31.65,10.04 31.65,10.02 31.71,9.96 31.71,9.73 31.26,9.29 | R19.2 25.77,23.76 | C37.1 25.84,19.58 v26.89,19.58 26.89,19.16 v29.26,16.79 31.37,16.79 31.4,16.75 31.62,16.75 U4.4 | 31.26,9.29 U4.17 31.31,9.16 31.44,9.29 | U4.21 33.08,8.27 33.08,8.62 32.02,9.68 31.82,9.68 31.44,9.29 | 31.44,9.29 31.26,9.29
  Top 0.2: R19.2 25.77,23.76 | C37.1 R20.2 25.73,23.74 25.72,23.74 R19.2 C9.1 C10.1 25.73,27.86 C25.1 25.75,29.91 L2.2
  Bottom 0.152: v28.2,10.09 28.2,9.53 v28.87,8.86 | v29.26,16.79 29.26,16.41 v30.3,15.37
WIZ_RST  (via drill 0.35)
  Top 0.152: U4.37 39.97,12.98 40.64,13.65 v40.64,14.29 R8.1 | IC2.22 54.2,4.54 v54.61,4.13
  Bottom 0.152: v54.61,4.13 51.75,6.99 47.31,6.99 46.82,6.99 46.59,6.75 46.12,6.75 45.8,7.07 45.8,8.49 40.64,13.65 v40.64,14.29

### Text on the board
tPlace: Maglock / Rev-C | + - | 1 | 2 | 3 | 4 | + - | 13
Document: + | + | + | + | + | +
tDocu: A5 | A4 | A3 | A2 | A1 | A0 | 9 | 10 | 11 | 12 | 13 | 0 | 1 | 2 | 3 | 4 | 5 | 6 | 7 | 8